# EAGLE design Espressomaschine (EAGLE 9.6.1)
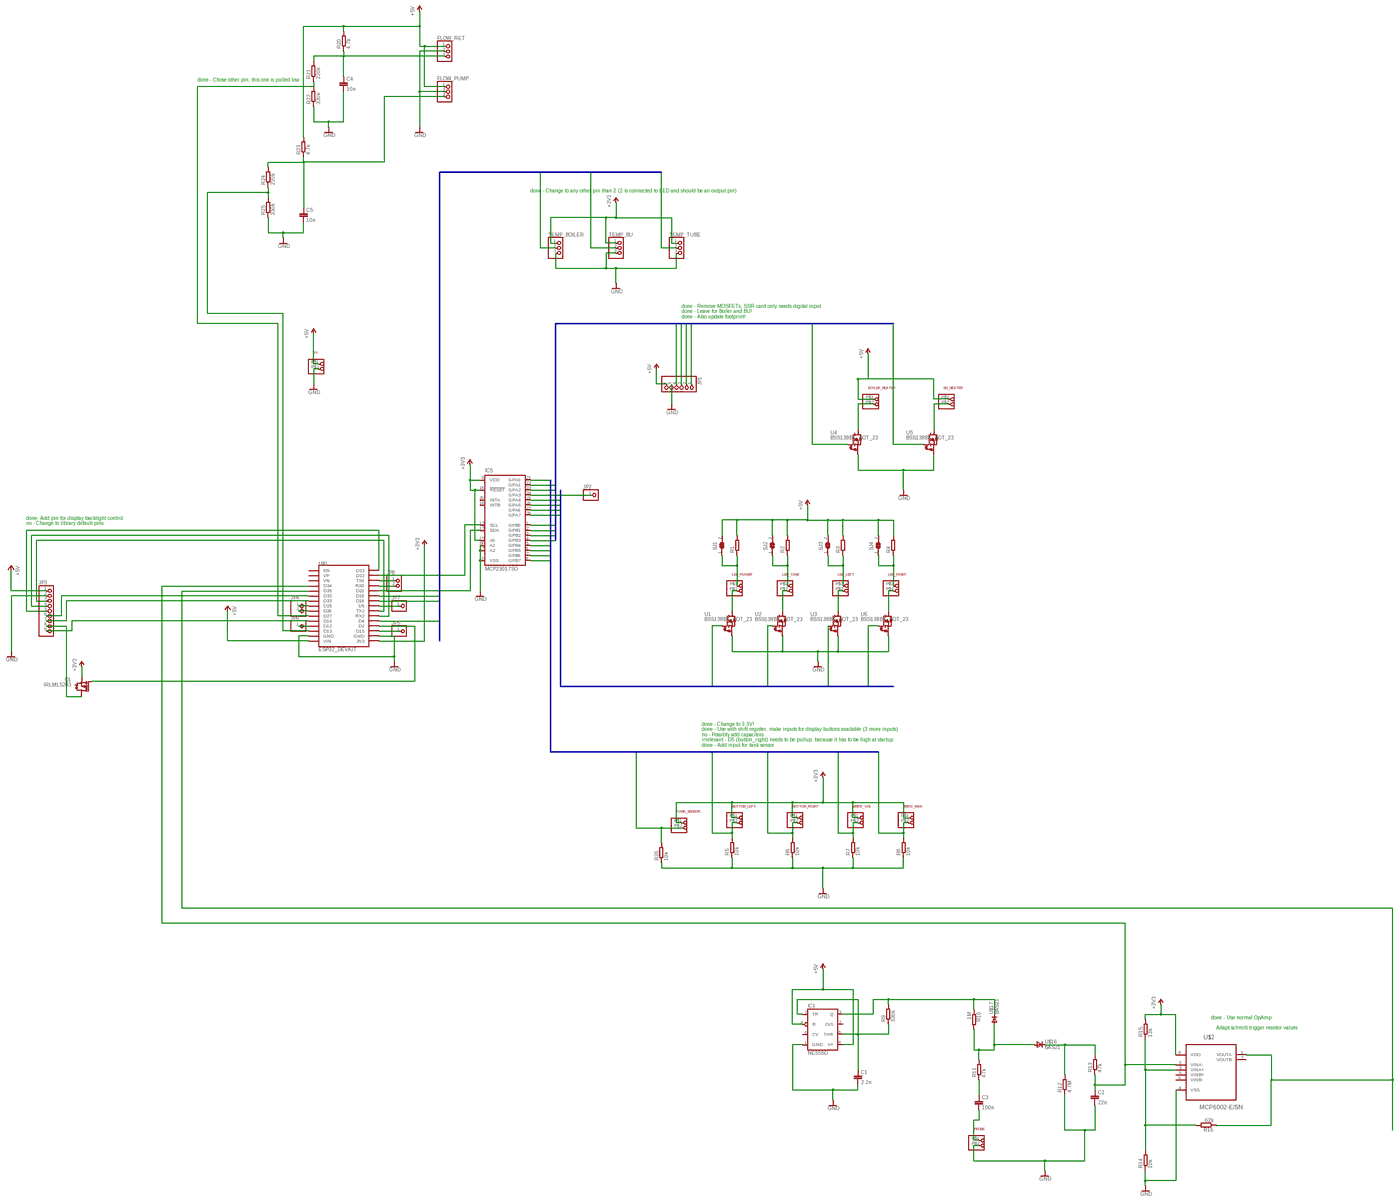
[diagram p0: schematic, sheet 1, overview]
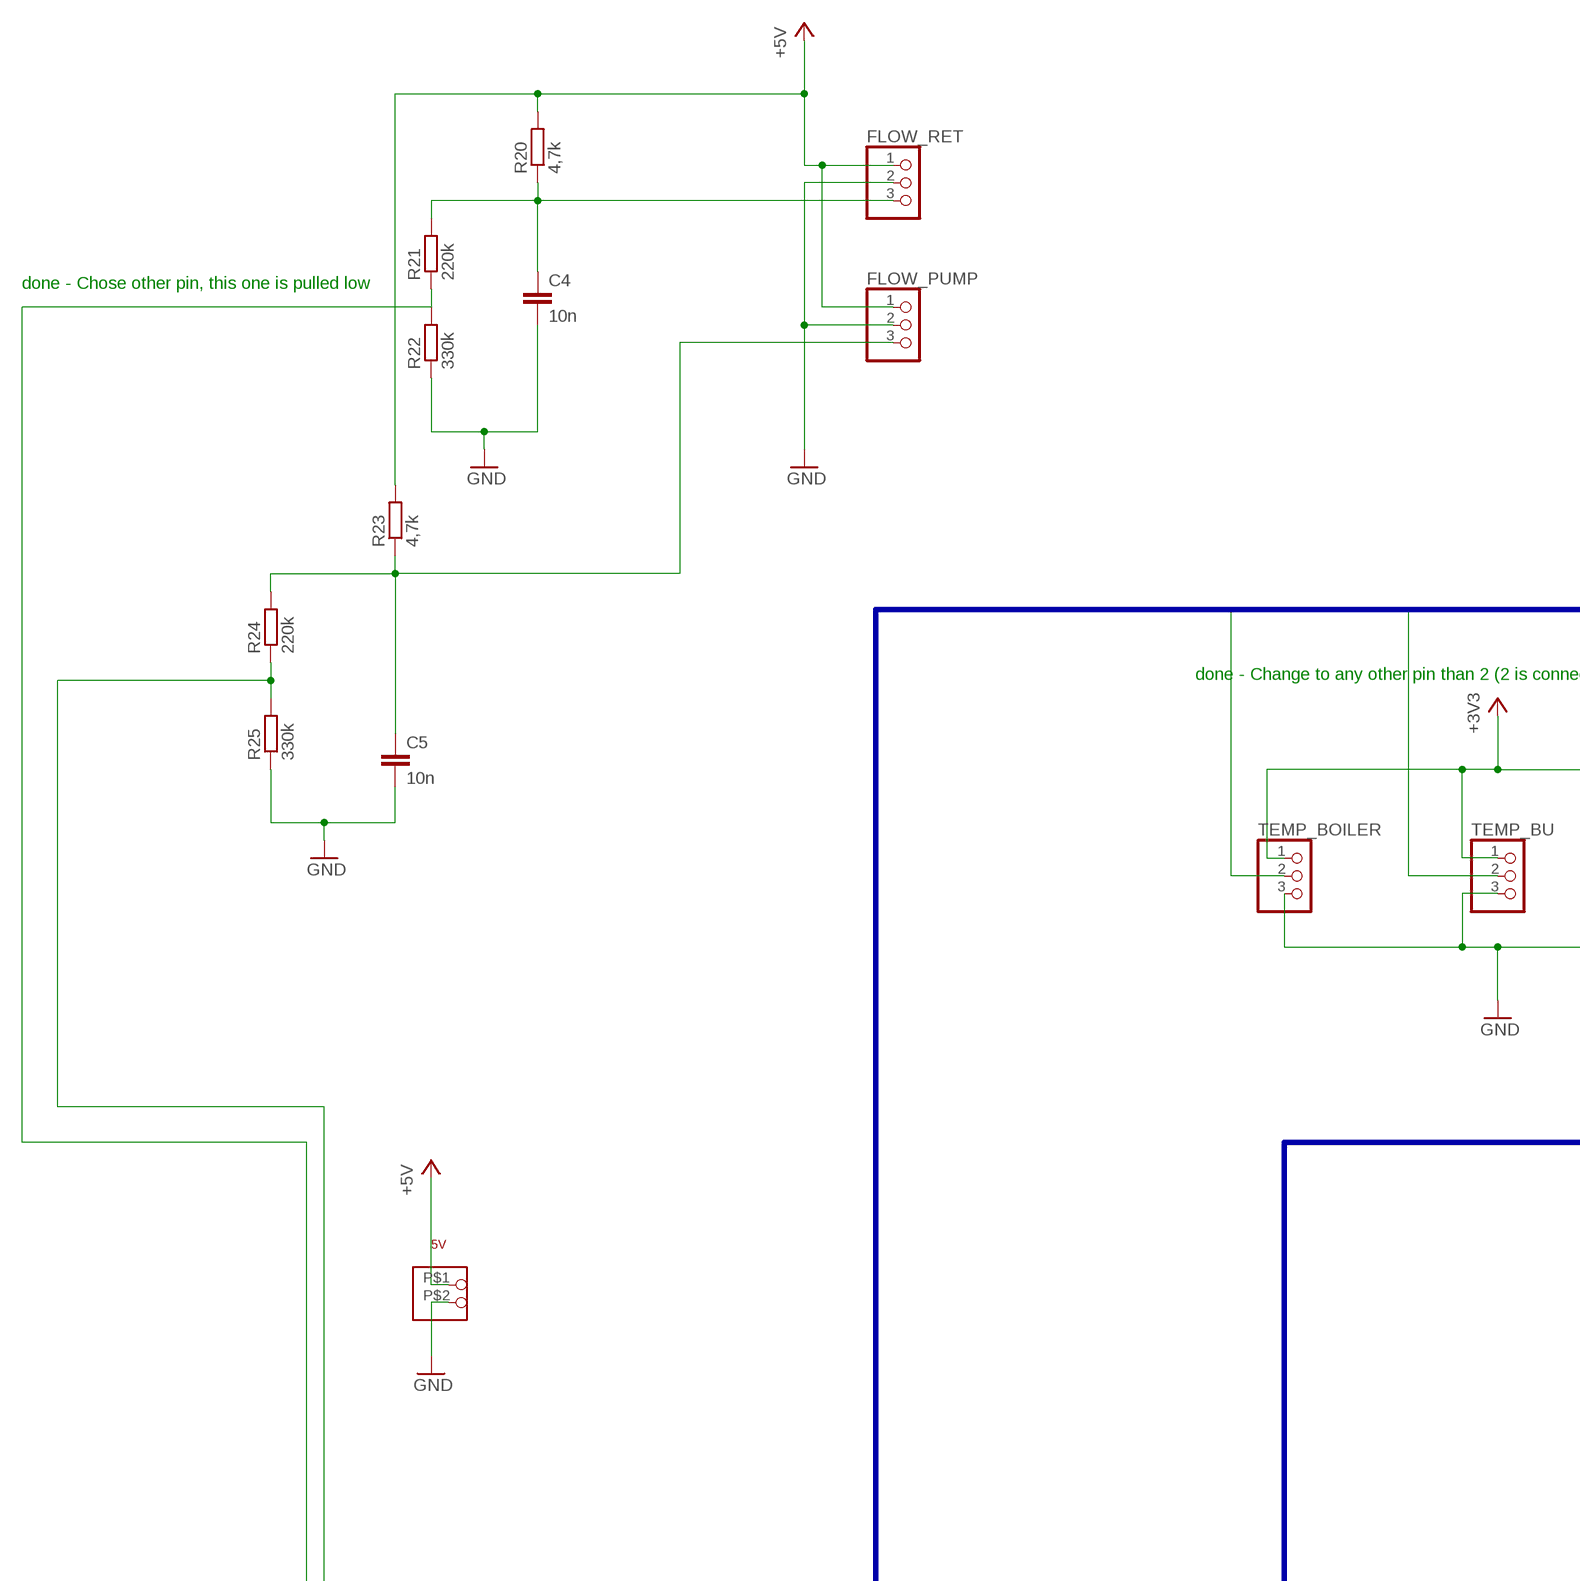
[diagram p1: schematic, sheet 1, part 1 of 4]
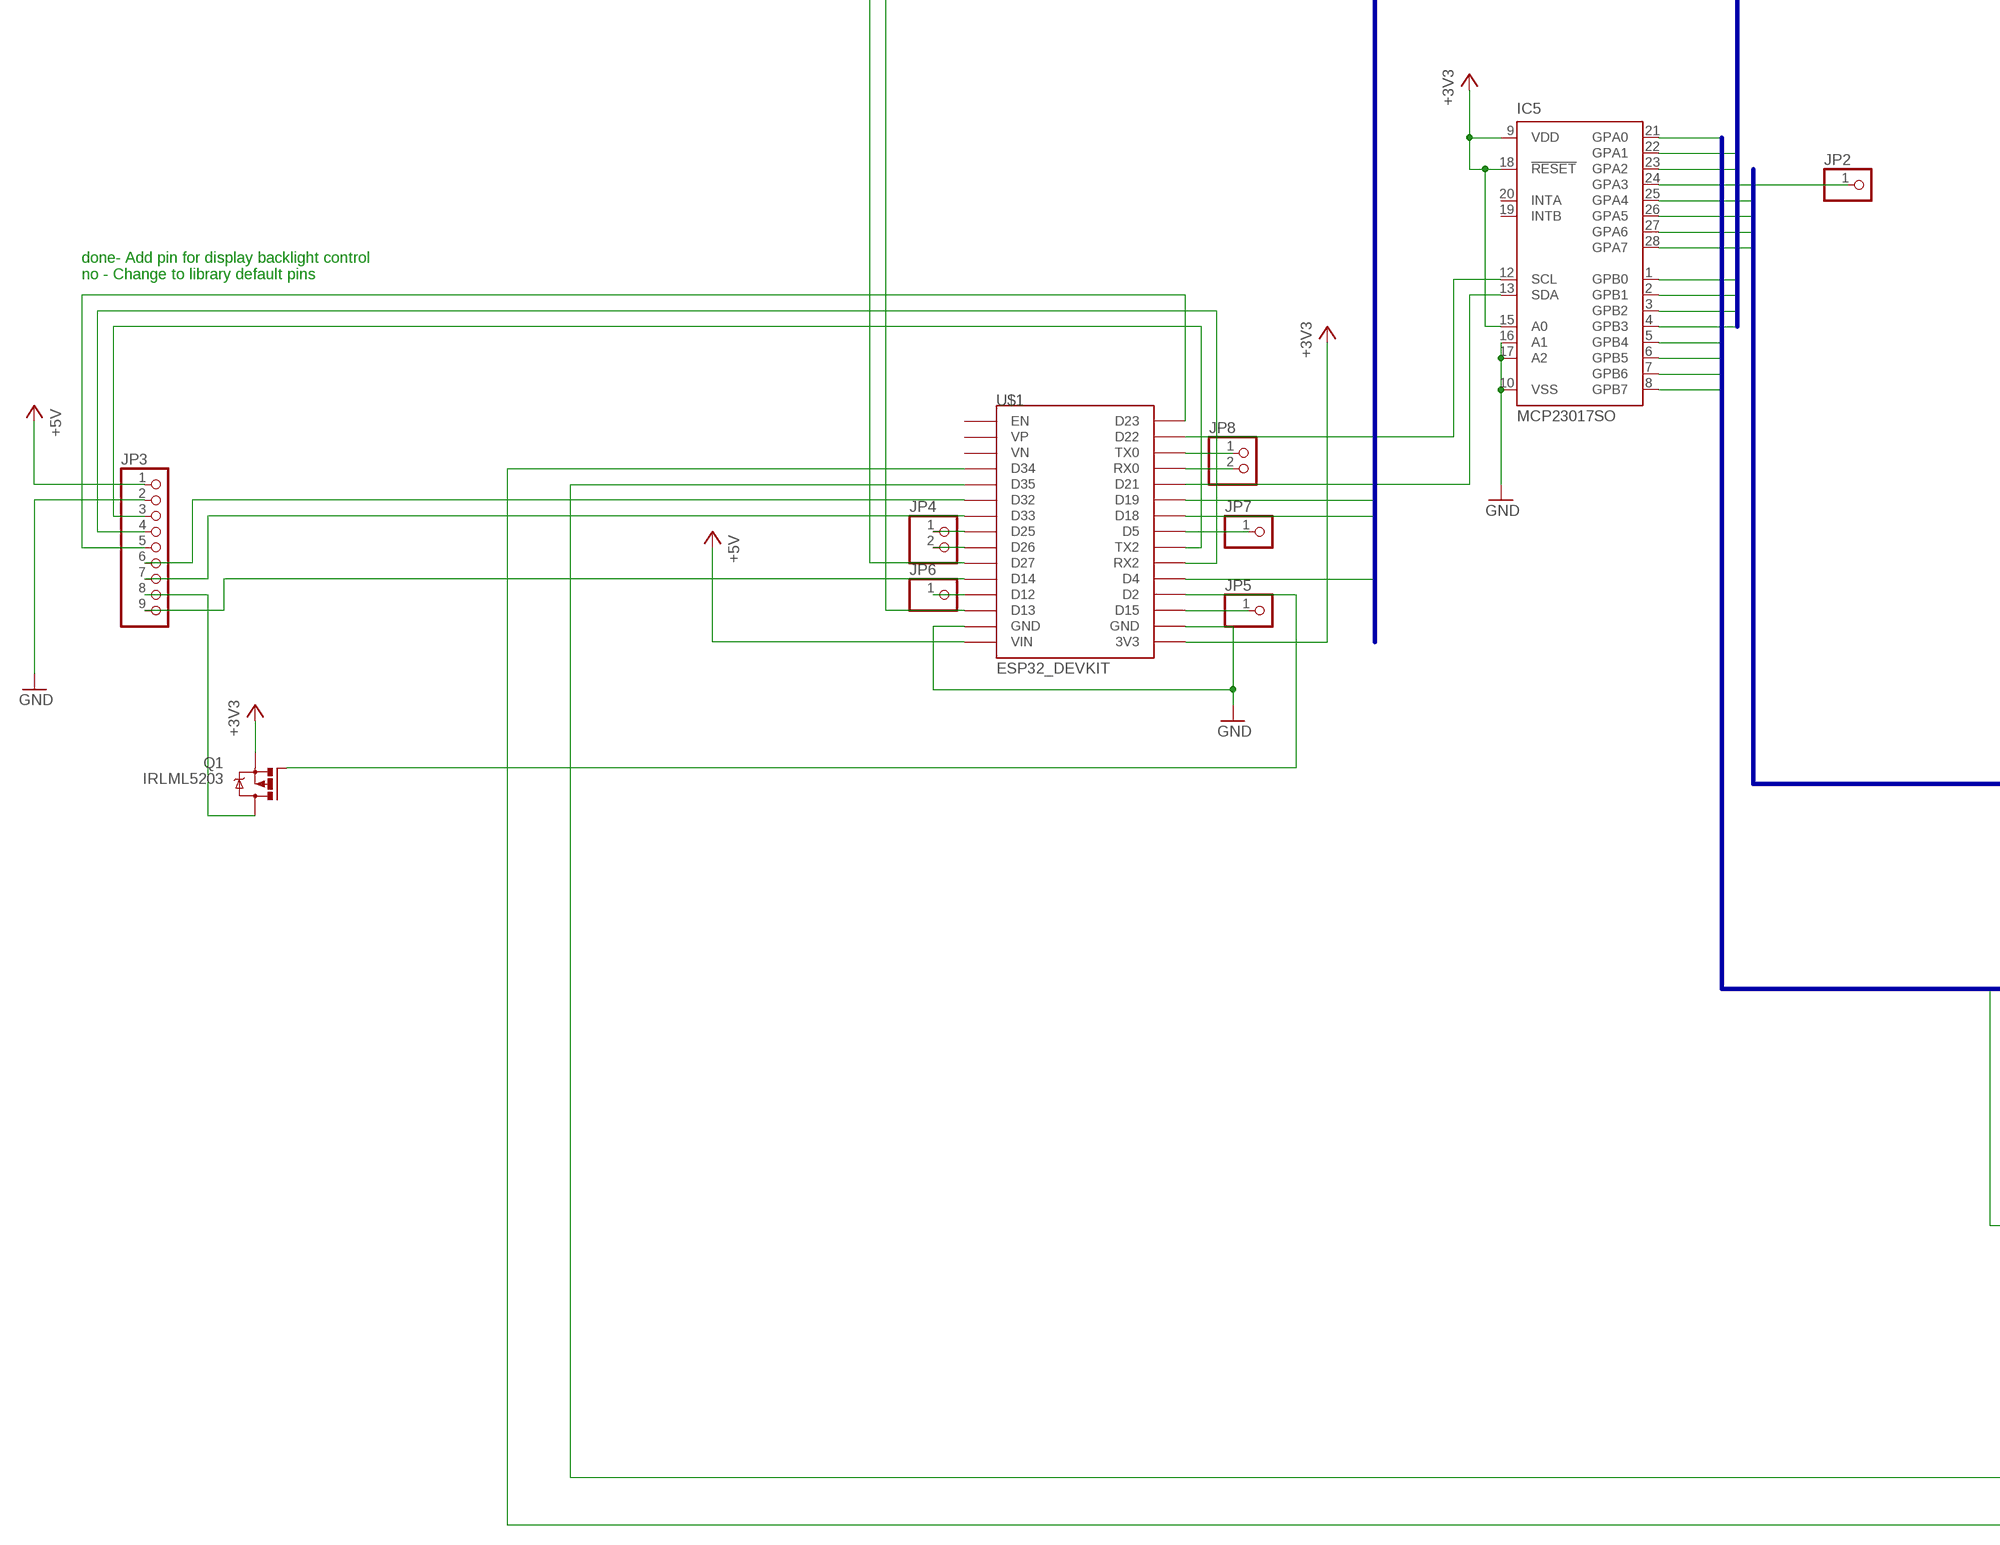
[diagram p2: schematic, sheet 1, part 2 of 4]
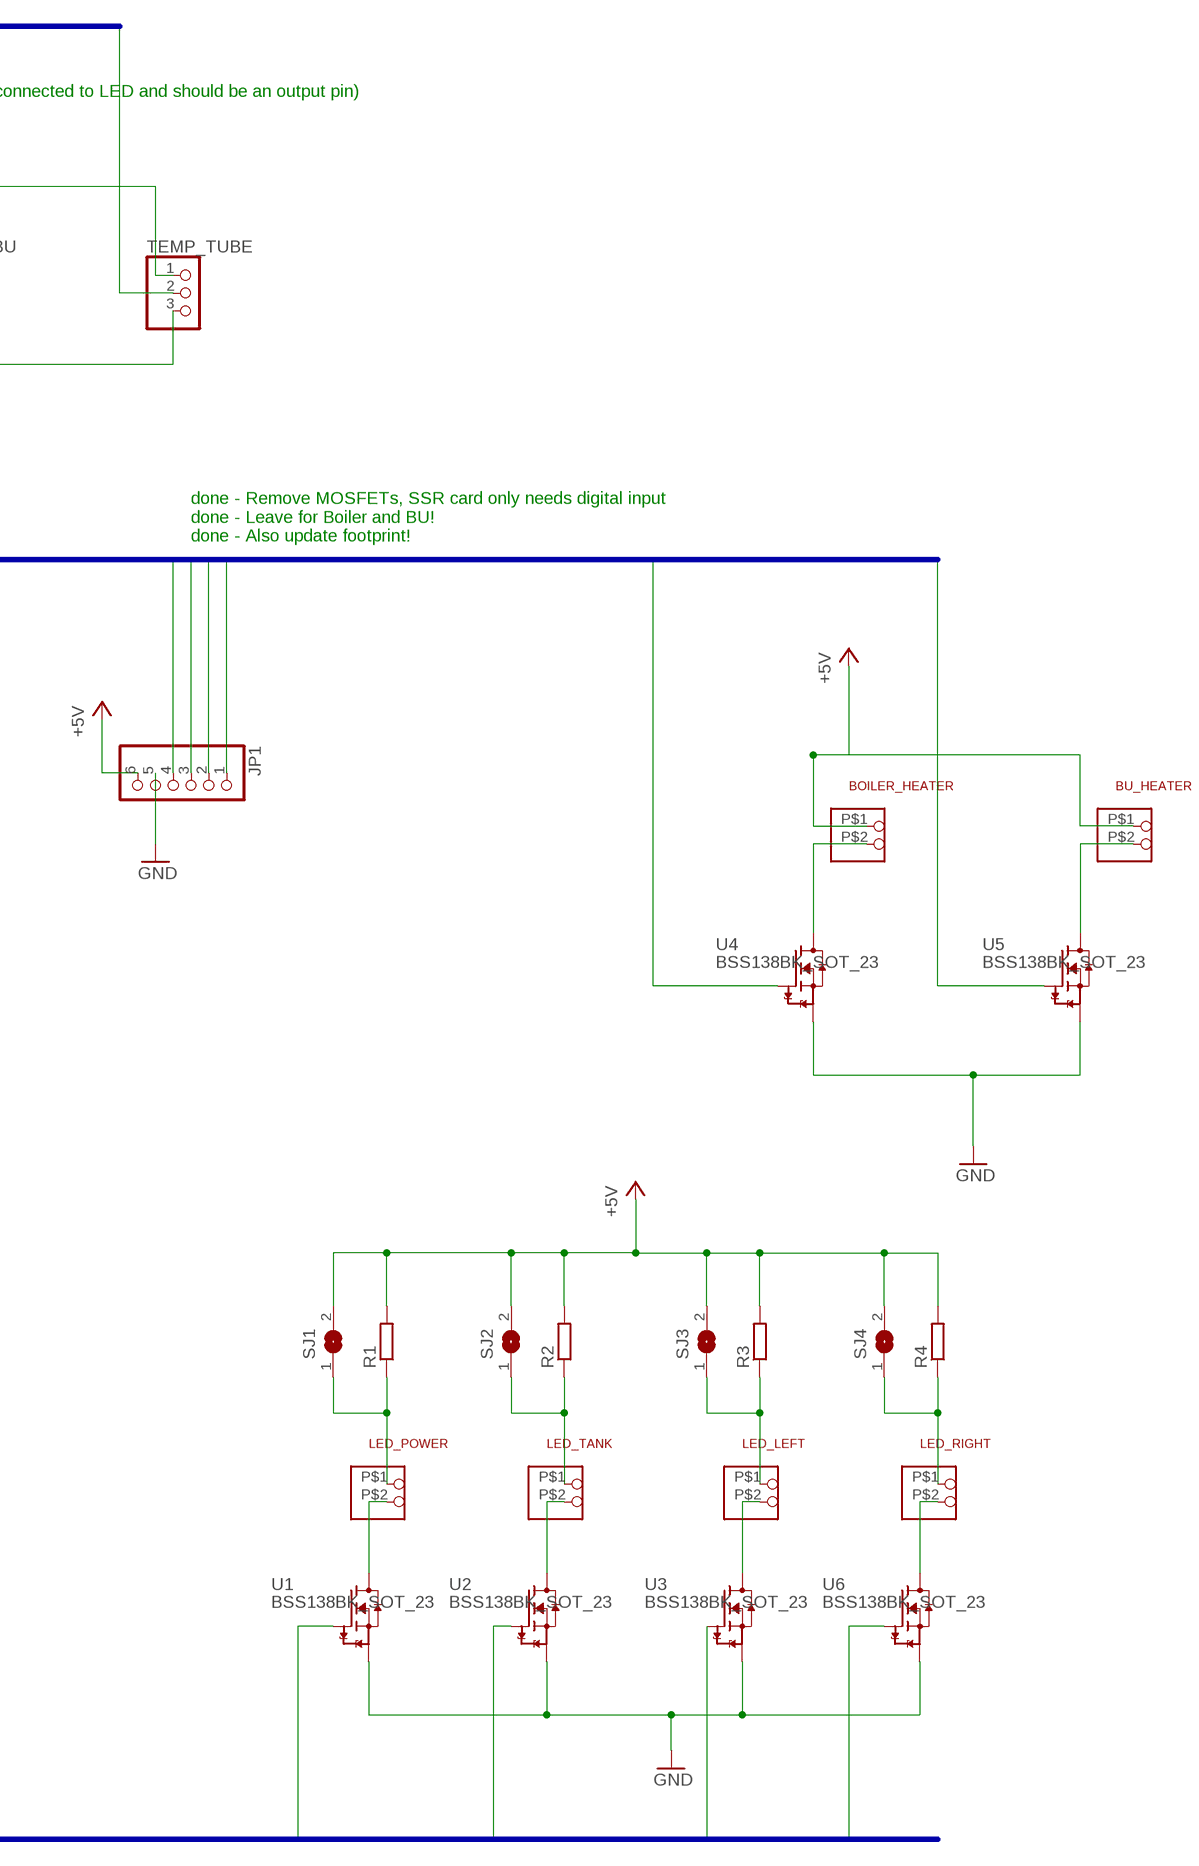
[diagram p3: schematic, sheet 1, part 3 of 4]
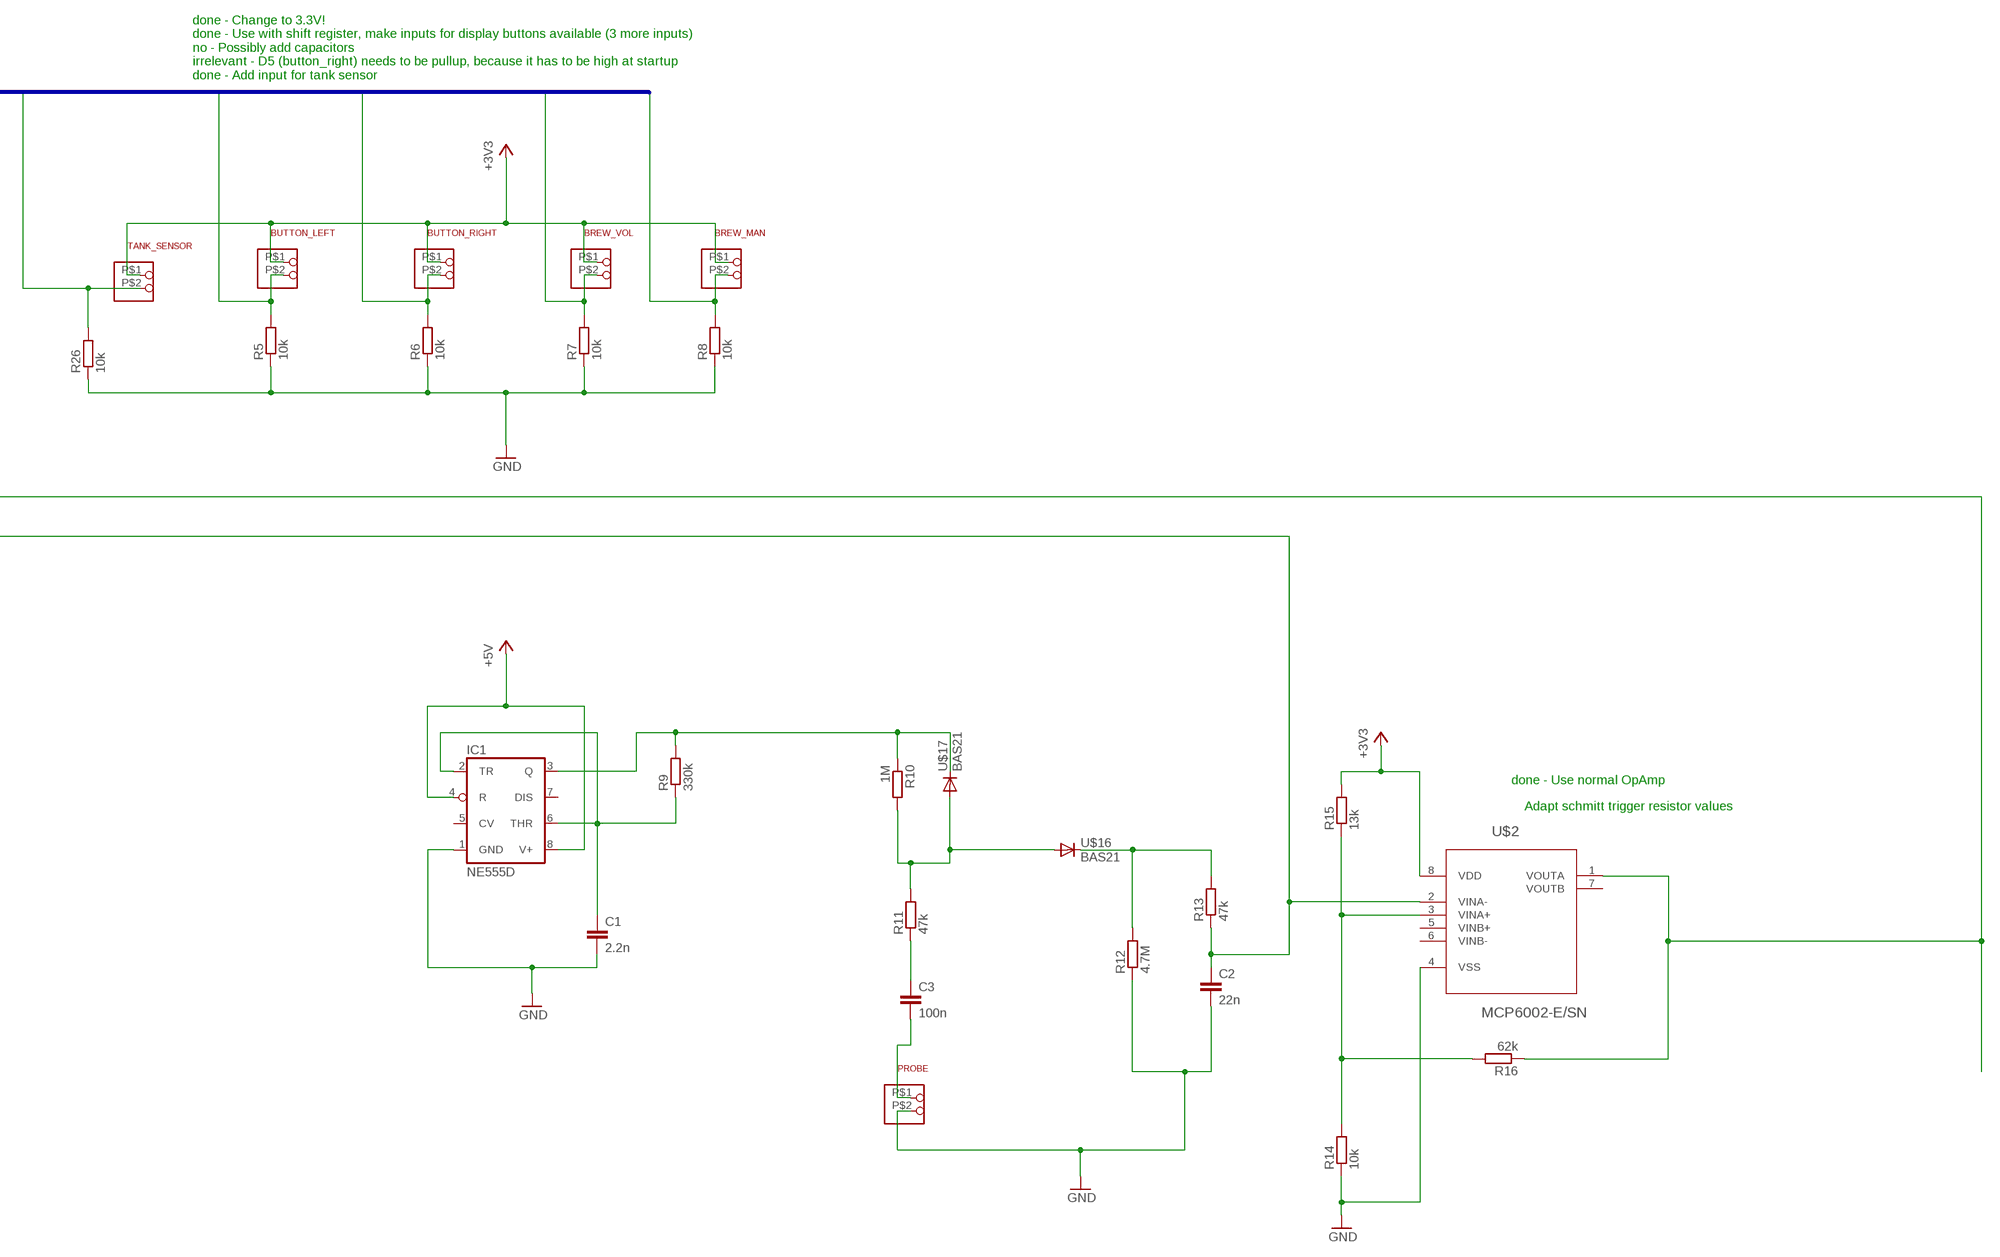
[diagram p4: schematic, sheet 1, part 4 of 4]

## Parts
5V  1X2RM5  [1X02_RM5]
BOILER_HEATER  1X2RM5  [1X02_RM5]
BREW_MAN  1X2RM5  [1X02_RM5]
BREW_VOL  1X2RM5  [1X02_RM5]
BU_HEATER  1X2RM5  [1X02_RM5]
BUTTON_LEFT  1X2RM5  [1X02_RM5]
BUTTON_RIGHT  1X2RM5  [1X02_RM5]
C1  2.2n  C-EUC0603  [C0603]
C2  22n  C-EUC0603  [C0603]
C3  100n  C-EUC0603  [C0603]
C4  10n  C-EUC0603  [C0603]
C5  10n  C-EUC0603  [C0603]
FLOW_PUMP  PINHD-1X3  [1X03]
FLOW_RET  PINHD-1X3  [1X03]
IC1  NE555D  [SO08]
IC5  MCP23017SO  [SO28W]
JP1  PINHD-1X6  [1X06]
JP2  PINHD-1X1  [1X01]
JP3  PINHD-1X9  [1X09]
JP4  PINHD-1X2  [1X02]
JP5  PINHD-1X1  [1X01]
JP6  PINHD-1X1  [1X01]
JP7  PINHD-1X1  [1X01]
JP8  PINHD-1X2  [1X02]
LED_LEFT  1X2RM5  [1X02_RM5]
LED_POWER  1X2RM5  [1X02_RM5]
LED_RIGHT  1X2RM5  [1X02_RM5]
LED_TANK  1X2RM5  [1X02_RM5]
PROBE  1X2RM5  [1X02_RM5]
Q1  IRLML5203  [MICRO3]
R1  R-EU_R0603  [R0603]
R2  R-EU_R0603  [R0603]
R3  R-EU_R0603  [R0603]
R4  R-EU_R0603  [R0603]
R5  10k  R-EU_R0603  [R0603]
R6  10k  R-EU_R0603  [R0603]
R7  10k  R-EU_R0603  [R0603]
R8  10k  R-EU_R0603  [R0603]
R9  330k  R-EU_R0603  [R0603]
R10  1M  R-EU_R0603  [R0603]
R11  47k  R-EU_R0603  [R0603]
R12  4.7M  R-EU_R0603  [R0603]
R13  47k  R-EU_R0603  [R0603]
R14  10k  R-EU_R0603  [R0603]
R15  13k  R-EU_R0603  [R0603]
R16  62k  R-EU_R0603  [R0603]
R20  4,7k  R-EU_R0603  [R0603]
R21  220k  R-EU_R0603  [R0603]
R22  330k  R-EU_R0603  [R0603]
R23  4,7k  R-EU_R0603  [R0603]
R24  220k  R-EU_R0603  [R0603]
R25  330k  R-EU_R0603  [R0603]
R26  10k  R-EU_R0603  [R0603]
SJ1  SJ  [SJ]
SJ2  SJ  [SJ]
SJ3  SJ  [SJ]
SJ4  SJ  [SJ]
TANK_SENSOR  1X2RM5  [1X02_RM5]
TEMP_BOILER  PINHD-1X3  [1X03]
TEMP_BU  PINHD-1X3  [1X03]
TEMP_TUBE  PINHD-1X3  [1X03]
U1  BSS138BK_SOT_23  [SOT23]
U2  BSS138BK_SOT_23  [SOT23]
U3  BSS138BK_SOT_23  [SOT23]
U4  BSS138BK_SOT_23  [SOT23]
U5  BSS138BK_SOT_23  [SOT23]
U6  BSS138BK_SOT_23  [SOT23]
U$1  ESP32_DEVKIT  [ESP32_DEVKIT]
U$2  MCP6002-E/SN  [SOIC127P600X175-8N]
U$16  BAS21  [SOT23]
U$17  BAS21  [SOT23]

## Nets
+3V3: BREW_MAN.P$1 BREW_VOL.P$1 BUTTON_LEFT.P$1 BUTTON_RIGHT.P$1 IC5.9(VDD) IC5.15(A0) IC5.18(!RESET) Q1.2(S) R15.2 TANK_SENSOR.P$1 TEMP_BOILER.1 TEMP_BU.1 TEMP_TUBE.1 U$1.3V3 U$2.8(VDD)
+5V: 5V.P$1 BOILER_HEATER.P$1 BU_HEATER.P$1 FLOW_PUMP.1 FLOW_RET.1 IC1.4(R) IC1.8(V+) JP1.6 JP3.1 R1.2 R2.2 R3.2 R4.2 R20.2 R23.2 SJ1.2 SJ2.2 SJ3.2 SJ4.2 U$1.VIN
BOILER_HEATER: IC5.23(GPA2) U4.1(G)
BOILER_VALVE: IC5.1(GPB0) JP1.4
BREW_MAN: BREW_MAN.P$2 IC5.8(GPB7) R8.2
BREW_VOL: BREW_VOL.P$2 IC5.7(GPB6) R7.2
BU_HEATER: IC5.22(GPA1) U5.1(G)
BU_VALVE: IC5.2(GPB1) JP1.3
BUTTON_LEFT: BUTTON_LEFT.P$2 IC5.6(GPB5) R5.2
BUTTON_RIGHT: BUTTON_RIGHT.P$2 IC5.5(GPB4) R6.2
EXP_VALVE: IC5.4(GPB3) JP1.1
GND: 5V.P$2 C1.2 C2.2 C4.2 C5.2 FLOW_PUMP.2 FLOW_RET.2 IC1.1(GND) IC5.10(VSS) IC5.16(A1) IC5.17(A2) JP1.5 JP3.2 PROBE.P$2 R5.1 R6.1 R7.1 R8.1 R12.1 R14.1 R22.1 R25.1 R26.1 TEMP_BOILER.3 TEMP_BU.3 TEMP_TUBE.3 U1.2(S) U2.2(S) U3.2(S) U4.2(S) U5.2(S) U6.2(S) U$1.GND@1(GND) U$1.GND@2(GND) U$2.4(VSS)
LED_LEFT: IC5.25(GPA4) U3.1(G)
LED_POWER: IC5.26(GPA5) U1.1(G)
LED_RIGHT: IC5.28(GPA7) U6.1(G)
LED_TANK: IC5.27(GPA6) U2.1(G)
N$1: LED_POWER.P$1 R1.1 SJ1.1
N$2: LED_TANK.P$1 R2.1 SJ2.1
N$3: LED_LEFT.P$1 R3.1 SJ3.1
N$4: Q1.1(G) U$1.D2
N$5: LED_RIGHT.P$2 U6.3(D)
N$6: LED_LEFT.P$2 U3.3(D)
N$7: BOILER_HEATER.P$2 U4.3(D)
N$8: BU_HEATER.P$2 U5.3(D)
N$9: LED_RIGHT.P$1 R4.1 SJ4.1
N$10: C1.1 IC1.2(TR) IC1.6(THR) R9.1
N$11: R10.2 R11.2 U$16.1(A) U$17.1(A)
N$12: C3.1 R11.1
N$13: IC1.3(Q) R9.2 R10.1 U$17.3(C)
N$14: R12.2 R13.2 U$16.3(C)
N$15: C2.1 R13.1 U$1.D34 U$2.2(VINA-)
N$16: R14.2 R15.1 R16.2 U$2.3(VINA+)
N$17: C3.2 PROBE.P$1
N$18: R16.1 U$1.D35 U$2.1(VOUTA)
N$19: IC5.24(GPA3) JP2.1
N$20: JP7.1 U$1.D5
N$21: LED_TANK.P$2 U2.3(D)
N$22: IC5.12(SCL) U$1.D22
N$23: LED_POWER.P$2 U1.3(D)
N$24: JP3.8 Q1.3(D)
N$25: JP4.1 U$1.D25
N$26: JP3.3 U$1.TX2
N$27: JP3.4 U$1.RX2
N$28: JP3.5 U$1.D23
N$29: JP3.6 U$1.D32
N$30: JP3.7 U$1.D33
N$31: JP3.9 U$1.D14
N$32: C4.1 FLOW_RET.3 R20.1 R21.2
N$33: C5.1 FLOW_PUMP.3 R23.1 R24.2
N$34: IC5.13(SDA) U$1.D21
N$35: R21.1 R22.2 U$1.D27
N$36: JP4.2 U$1.D26
N$37: JP5.1 U$1.D15
N$38: R24.1 R25.2 U$1.D13
N$39: JP6.1 U$1.D12
N$40: JP8.1 U$1.TX0
N$41: JP8.2 U$1.RX0
PUMP: IC5.3(GPB2) JP1.2
TANK_SENSOR: IC5.21(GPA0) R26.2 TANK_SENSOR.P$2
TEMP_BOILER: TEMP_BOILER.2 U$1.D19
TEMP_BU: TEMP_BU.2 U$1.D4
TEMP_TUBE: TEMP_TUBE.2 U$1.D18
Unconnected: IC1.5(CV) IC1.7(DIS) IC5.19(INTB) IC5.20(INTA) U$1.EN U$1.VN U$1.VP U$2.5(VINB+) U$2.6(VINB-) U$2.7(VOUTB)

## Buses
LED_LEFT,LED_POWER,LED_RIGHT,LED_TANK
BOILER_HEATER,BOILER_VALVE,BU_HEATER,BU_VALVE,EXP_VALVE,PUMP
BREW_MAN,BREW_VOL,BUTTON_LEFT,BUTTON_RIGHT,TANK_SENSOR
TEMP_BOILER,TEMP_BU,TEMP_TUBE

## Notes on the sheet
- done - Chose other pin, this one is pulled low
- done - Change to any other pin than 2 (2 is connected to LED and should be an output pin)
- done - Remove MOSFETs, SSR card only needs digital input
  done - Leave for Boiler and BU!
  done - Also update footprint!
- done- Add pin for display backlight control
  no - Change to library default pins
- done - Change to 3.3V!
  done - Use with shift register, make inputs for display buttons available (3 more inputs)
  no - Possibly add capacitors
  irrelevant - D5 (button_right) needs to be pullup, because it has to be high at startup
  done - Add input for tank sensor
- done - Use normal OpAmp
- Adapt schmitt trigger resistor values

## Library data of the parts
5V BOILER_HEATER BREW_MAN BREW_VOL BU_HEATER BUTTON_LEFT BUTTON_RIGHT LED_LEFT LED_POWER LED_RIGHT LED_TANK PROBE TANK_SENSOR = PINHD_eigen:1X2RM5
C1-C5 = rcl:C-EU: CAPACITOR, European symbol; SPICEPREFIX: C
FLOW_PUMP FLOW_RET TEMP_BOILER TEMP_BU TEMP_TUBE = pinhead:PINHD-1X3: PIN HEADER
IC1 = linear:*555: TIMER
IC5 = microchip:MCP23017: http://ww1.microchip.com/downloads/en/DeviceDoc/21952a.pdf Source: http://ww1.microchip.com/downloads/en/DeviceDoc/21952a.pdf; MF: MICROCHIP; MPN: MCP23017-E/SO; OC_FARNELL: 1332087; OC_NEWARK: 31K2958
JP1 = pinhead:PINHD-1X6: PIN HEADER
JP2 JP5-JP7 = pinhead:PINHD-1X1: PIN HEADER
JP3 = pinhead:PINHD-1X9: PIN HEADER
JP4 JP8 = pinhead:PINHD-1X2: PIN HEADER
Q1 = transistor-power:IRLML5203: HEXFET P-Channel Power MOSFET
R1-R16 R20-R26 = rcl:R-EU_: RESISTOR, European symbol; SPICEPREFIX: R
SJ1-SJ4 = jumper:SJ: SMD solder JUMPER
U1-U6 = Transistor:BSS138BK: N-channel Trench MOSFET
U$1 = ESP32:ESP32_DEVKIT: ESP32 DEVKIT BOARD
U$2 = Microchip_By_element14_Batch_1:MCP6002-E/SN: Low-Power Op Amp; DESCRIPTION: Low-Power Op Amp; MPN: MCP6002-E/SN; OC_FARNELL: 1332118; OC_NEWARK: 34M7473; PACKAGE: SOIC-8; SUPPLIER: Microchip
U$16 U$17 = Diode:BAS21

## Board
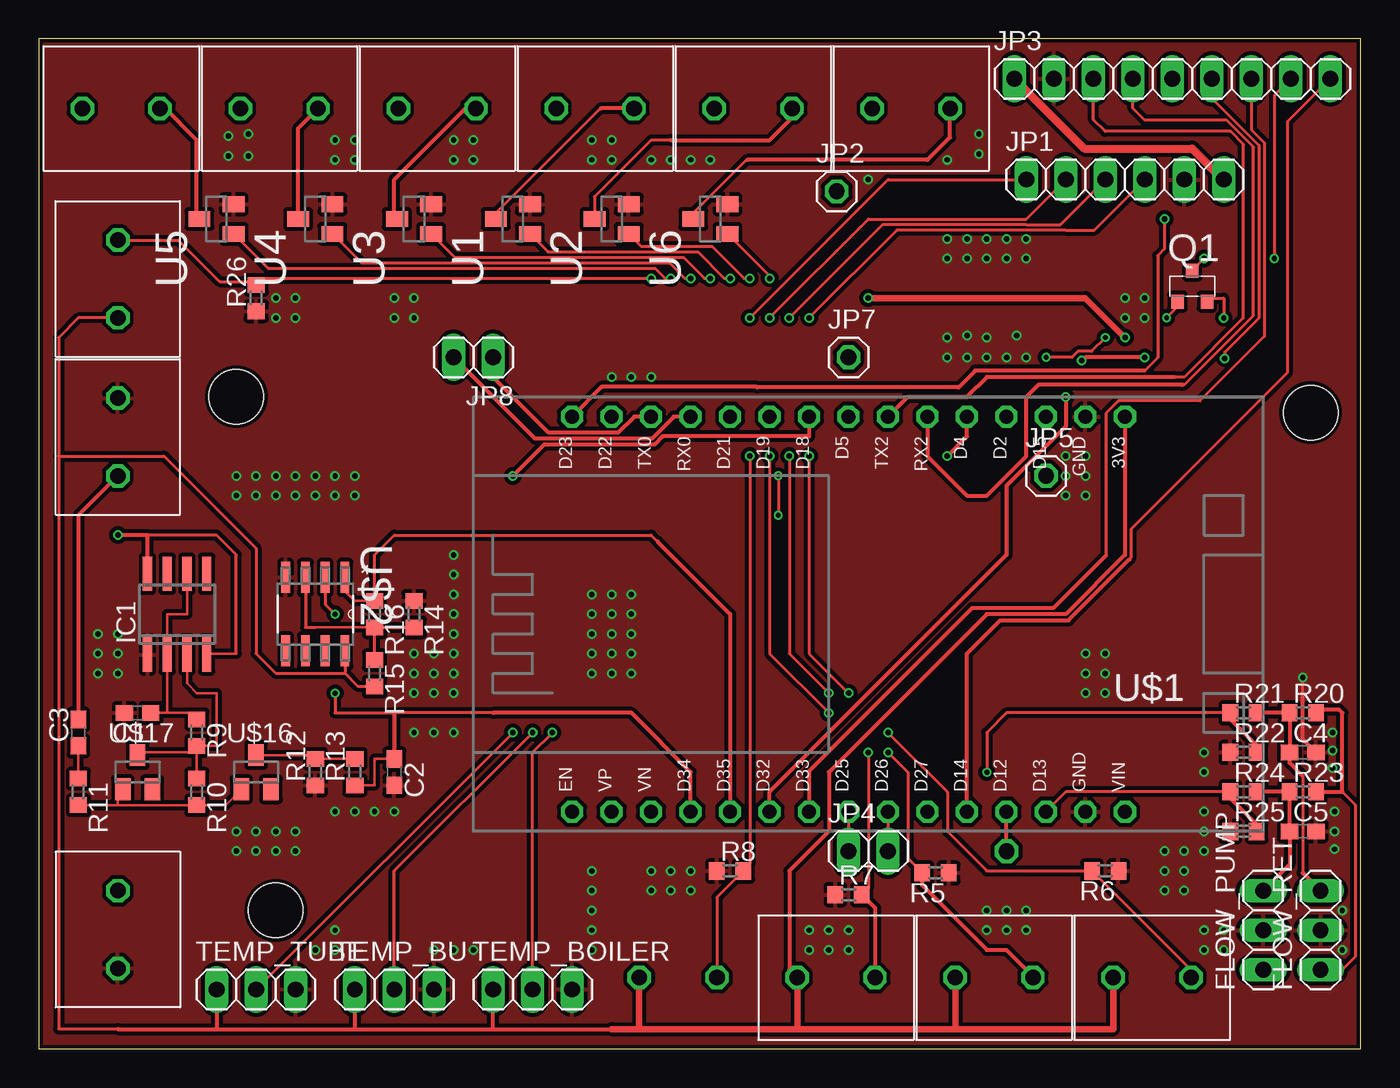
[diagram p5: board, top side]
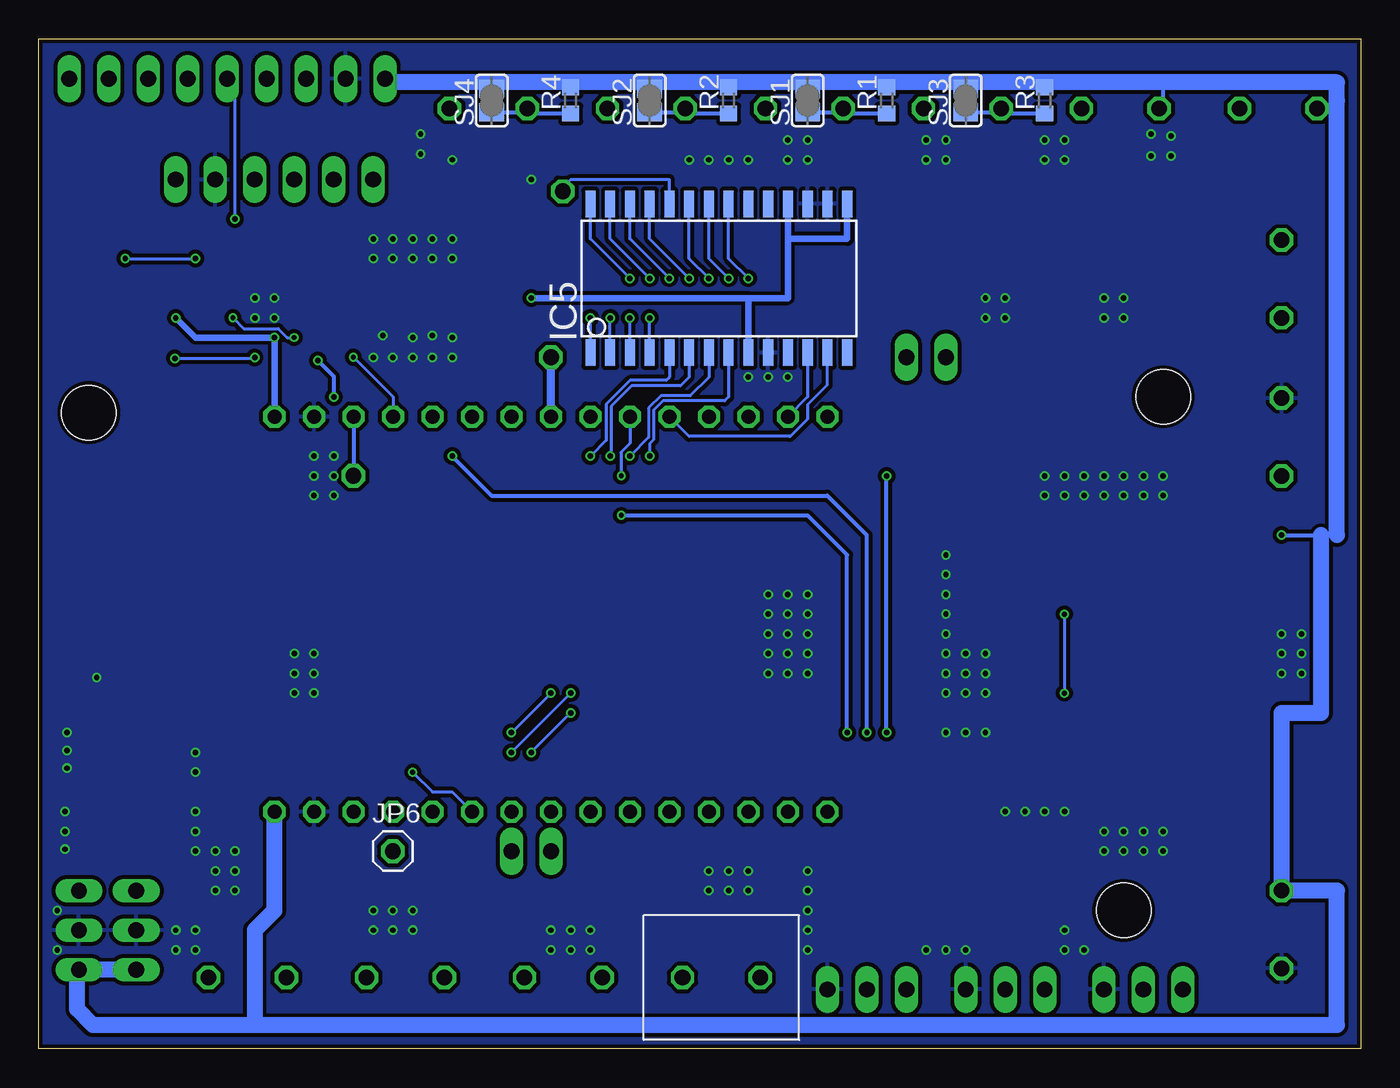
[diagram p6: board, bottom side, seen from below]

Size 85 x 64.92 mm. Coordinates in mm from the lower left corner, seen from the top.
Outline: 0,0 85,0 85,64.92 0,64.92 0,0
Copper layers (1*16): Top 0.035mm / dielectric 1.5mm / Bottom 0.035mm
Design rules "JLCpcb_2_layer": minimum track width 5mil, minimum drill 0.2mm, track to track 5mil, track to pad 0.2mm, pad to pad 0.54mm, via to via 0.28mm, smd to smd 0mil, copper to edge 10mil, drill to drill 10mil, minimum pad ring 0.13mm, minimum via ring 0.13mm, stop-mask expansion 0.05mm, vias tented up to drill 100mil, thermal gap 10mil
Holes 3.5 mm at 12.7,41.91 15.24,8.89 81.79,40.89

### Footprints (pad centres in the part's own frame; a part is rotated, then mirrored left to right if it is on the bottom)
1X02_RM5 = drill 1 octagon: P$1 0,0; P$2 5,0
C0603 = smd 1.1 x 1: 1 -0.85,0; 2 0.85,0
1X03 = drill 1.016 long: 1 -2.54,0; 2 0,0; 3 2.54,0
SO08 = smd 0.6 x 2.2: 1 -1.905,-2.6; 2 -0.635,-2.6; 3 0.635,-2.6; 4 1.905,-2.6; 5 1.905,2.6; 6 0.635,2.6; 7 -0.635,2.6; 8 -1.905,2.6
SO28W = smd 0.65 x 1.7: 1 -7.62,-4.78; 2 -6.35,-4.78; 3 -5.08,-4.78; 4 -3.81,-4.78; 5 -2.54,-4.78; 6 -1.27,-4.78; 7 0,-4.78; 8 1.27,-4.78; 9 2.54,-4.78; 10 3.81,-4.78; 11 5.08,-4.78; 12 6.35,-4.78; 13 7.62,-4.78; 14 8.89,-4.78; 15 8.89,4.78; 16 7.62,4.78; 17 6.35,4.78; 18 5.08,4.78; 19 3.81,4.78; 20 2.54,4.78; 21 1.27,4.78; 22 0,4.78; 23 -1.27,4.78; 24 -2.54,4.78; 25 -3.81,4.78; 26 -5.08,4.78; 27 -6.35,4.78; 28 -7.62,4.78
1X06 = drill 1.016 long: 1 -6.35,0; 2 -3.81,0; 3 -1.27,0; 4 1.27,0; 5 3.81,0; 6 6.35,0
1X01 = drill 1.016 octagon: 1 0,0
1X09 = drill 1.016 long: 1 -10.16,0; 2 -7.62,0; 3 -5.08,0; 4 -2.54,0; 5 0,0; 6 2.54,0; 7 5.08,0; 8 7.62,0; 9 10.16,0
1X02 = drill 1.016 long: 1 -1.27,0; 2 1.27,0
MICRO3 = smd 0.8 x 0.9: 1 -0.95,-1; 2 0.95,-1; 3 0,1
R0603 = smd 1 x 1.1: 1 -0.85,0; 2 0.85,0
SJ = smd 1.168 x 1.6: 1 -0.762,0; 2 0.762,0
SOT23 = smd 1 x 1.4: 1 -0.95,-1.1; 2 0.95,-1.1; 3 0,1.1
ESP32_DEVKIT = drill 0.9 pad 1.422 octagon: 3V3 11.43,-17.78; D2 11.43,-10.16; D4 11.43,-7.62; D5 11.43,0; D12 -13.97,-10.16; D13 -13.97,-12.7; D14 -13.97,-7.62; D15 11.43,-12.7; D18 11.43,2.54; D19 11.43,5.08; D21 11.43,7.62; D22 11.43,15.24; D23 11.43,17.78; D25 -13.97,0; D26 -13.97,-2.54; D27 -13.97,-5.08; D32 -13.97,5.08; D33 -13.97,2.54; D34 -13.97,10.16; D35 -13.97,7.62; EN -13.97,17.78; GND@1 -13.97,-15.24; GND@2 11.43,-15.24; RX0 11.43,10.16; RX2 11.43,-5.08; TX0 11.43,12.7; TX2 11.43,-2.54; VIN -13.97,-17.78; VN -13.97,12.7; VP -13.97,15.24
SOIC127P600X175-8N = smd 1.981 x 0.559: 1 -2.362,1.905; 2 -2.362,0.635; 3 -2.362,-0.635; 4 -2.362,-1.905; 5 2.362,-1.905; 6 2.362,-0.635; 7 2.362,0.635; 8 2.362,1.905

### Placement (x,y rotation side)
5V  5.08,10.16 270 top
BOILER_HEATER  12.95,60.45 0 top
BREW_MAN  38.61,4.57 180 bottom
BREW_VOL  48.77,4.57 0 top
BU_HEATER  2.79,60.45 0 top
BUTTON_LEFT  58.93,4.57 0 top
BUTTON_RIGHT  69.09,4.57 0 top
C1  6.35,21.59 180 top
C2  22.86,17.78 270 top
C3  2.54,20.32 90 top
C4  81.28,19.05 0 top
C5  81.28,13.97 0 top
FLOW_PUMP  78.74,7.62 90 top
FLOW_RET  82.42,7.62 90 top
IC1  8.89,27.94 0 top
IC5  41.91,49.53 0 bottom
JP1  69.85,55.88 0 top
JP2  51.31,55.12 0 top
JP3  72.9,62.36 0 top
JP4  53.34,12.7 0 top
JP5  64.77,36.83 0 top
JP6  62.23,12.7 0 bottom
JP7  52.07,44.45 0 top
JP8  27.94,44.45 180 top
LED_LEFT  23.11,60.45 0 top
LED_POWER  33.27,60.45 0 top
LED_RIGHT  53.59,60.45 0 top
LED_TANK  43.43,60.45 0 top
PROBE  5.08,36.83 90 top
Q1  74.17,49.02 0 top
R1  30.48,60.96 90 bottom
R2  40.64,60.96 90 bottom
R3  20.32,60.96 90 bottom
R4  50.8,60.96 90 bottom
R5  57.66,11.3 180 top
R6  68.58,11.43 180 top
R7  52.07,9.91 0 top
R8  44.45,11.43 0 top
R9  10.16,20.32 270 top
R10  10.16,16.51 270 top
R11  2.54,16.51 270 top
R12  17.78,17.78 90 top
R13  20.32,17.78 90 top
R14  24.13,27.94 270 top
R15  21.59,24.13 270 top
R16  21.59,27.94 270 top
R20  81.28,21.59 0 top
R21  77.47,21.59 0 top
R22  77.47,19.05 0 top
R23  81.28,16.51 0 top
R24  77.47,16.51 0 top
R25  77.47,13.97 0 top
R26  13.97,48.26 90 top
SJ1  35.56,60.96 90 bottom
SJ2  45.72,60.96 90 bottom
SJ3  25.4,60.96 90 bottom
SJ4  55.88,60.96 90 bottom
TANK_SENSOR  5.08,46.99 90 top
TEMP_BOILER  31.75,3.81 0 top
TEMP_BU  22.86,3.81 0 top
TEMP_TUBE  13.97,3.81 0 top
U1  30.48,53.34 90 top
U2  36.83,53.34 90 top
U3  24.13,53.34 90 top
U4  17.78,53.34 90 top
U5  11.43,53.34 90 top
U6  43.18,53.34 90 top
U$1  52.07,29.21 90 top
U$2  17.78,27.94 270 top
U$16  13.97,17.78 0 top
U$17  6.35,17.78 0 top

### Tracks (layer width: path | path; a pad name or v marks a point on that pad's centre or on a via)
+3V3  (via drill 0.35)
  Top 0.2: Q1.2 75.36,48.26 76.2,48.26 | U$2.8 19.68,24.13 | 19.68,24.13 15.24,24.13 13.97,25.4 13.97,32.18 8.05,38.1 1.27,38.1 | R15.2 20.54,23.28 19.68,24.13
  Top 0.203: 76.2,48.26 v76.2,46.99 | TANK_SENSOR.P$1 2.54,46.99 1.27,45.72 1.27,38.1 1.27,1.27 5.08,1.27
  Top 0.254: TEMP_TUBE.1 11.43,1.27 | 5.08,1.27 11.43,1.27 | 11.43,1.27 20.32,1.27 | 20.32,1.27 29.21,1.27 | 29.21,1.27 TEMP_BOILER.1 | TEMP_BU.1 20.32,1.27 | U$1.3V3 69.85,31.75 66.04,27.94 60.96,27.94 50.8,17.78 50.8,13.97 48.26,11.43 48.26,5.08 BREW_VOL.P$1 | 29.21,1.27 36.83,1.27
  Top 0.406: BUTTON_RIGHT.P$1 69.09,1.27 58.93,1.27 | 36.83,1.27 38.61,1.27 | 38.61,1.27 48.77,1.27 | 48.77,1.27 58.93,1.27 | BUTTON_LEFT.P$1 58.93,1.27 | BREW_VOL.P$1 48.77,1.27 | BREW_MAN.P$1 38.61,1.27 | v69.85,45.72 67.31,48.26 v53.34,48.26
  Bottom 0.406: v76.2,46.99 74.93,45.72 v69.85,45.72 U$1.3V3 | IC5.15 33.02,52.07 36.83,52.07 | 36.83,52.07 IC5.18 | IC5.9 39.37,48.26 | 39.37,48.26 36.83,48.26 36.83,52.07 | 39.37,48.26 v53.34,48.26
+5V  (via drill 0.35)
  Top 0.152: 12.7,25.4 10.79,25.4 IC1.4
  Top 0.2: 83.82,16.51 84.65,15.68 84.65,5.91 83.82,5.08 FLOW_RET.1 | 6.99,33.02 11.43,33.02 12.7,31.75 12.7,25.4
  Top 0.254: v5.08,33.02 6.99,33.02 IC1.8 | R20.2 82.34,21.8 83.61,21.8 83.82,21.59 83.82,16.51 R23.2
  Top 0.508: JP3.1 67.24,57.86 74.16,57.86 76.14,55.88 JP1.6
  Bottom 0.2: 69.85,8.89 69.85,9.14
  Bottom 0.254: v5.08,33.02 2.54,33.02 1.52,33.02 | BU_HEATER.P$1 2.03,60.45 1.52,60.96 | BOILER_HEATER.P$1 12.7,60.71 12.7,62.13 | R3.2 20.32,62.13 | SJ3.2 25.4,62.13 | R1.2 30.48,62.13 | SJ1.2 35.56,62.13 | R2.2 40.64,62.13 | SJ2.2 45.72,62.13 | R4.2 50.8,62.13 | SJ4.2 55.88,62.13
  Bottom 1.016: 2.54,33.02 2.54,21.59 5.08,21.59 5V.P$1 1.52,10.16 1.52,1.52 71.12,1.52 | 1.52,33.02 1.52,60.96 1.52,62.13 12.7,62.13 20.32,62.13 25.4,62.13 30.48,62.13 35.56,62.13 40.64,62.13 45.72,62.13 50.8,62.13 55.88,62.13 62.51,62.13 JP3.1 | 69.85,8.89 71.12,7.62 71.12,1.52 | 69.85,9.14 U$1.VIN | 71.12,1.52 81.53,1.52 82.55,2.54 82.55,4.95 FLOW_RET.1 FLOW_PUMP.1
BOILER_HEATER  (via drill 0.35)
  Top 0.203: U4.1 20.75,50.52 40.55,50.52 41.53,49.53 v41.91,49.53
  Bottom 0.203: v41.91,49.53 43.18,50.8 IC5.23
BOILER_VALVE  (via drill 0.35)
  Top 0.2: 66.04,52.63 67.87,52.63 JP1.4
  Top 0.203: v49.53,46.99 55.17,52.63 66.04,52.63
  Bottom 0.203: IC5.1 v49.53,46.99
BREW_MAN  (via drill 0.35)
  Top 0.2: BREW_MAN.P$2 43.61,9.74 R8.2 45.72,11.85 v45.72,38.1
  Bottom 0.2: IC5.8 40.64,41.91 40.9,41.65 44.87,41.65 45.46,41.06 45.46,39.17 45.72,38.91 v45.72,38.1
BREW_VOL  (via drill 0.35)
  Top 0.2: v46.99,38.1 46.99,25.4 v50.8,21.59 | v53.34,19.05 53.34,10.33 R7.2
  Top 0.254: R7.2 53.77,9.06 BREW_VOL.P$2
  Bottom 0.2: IC5.7 41.91,43.18 43.11,41.98 45,41.98 45.79,41.19 45.79,39.3 v46.99,38.1 | v50.8,21.59 v53.34,19.05
BU_HEATER  (via drill 0.35)
  Top 0.203: v40.64,49.53 40.26,49.53 39.63,50.16 14.76,50.16 U5.1
  Bottom 0.203: v40.64,49.53 41.91,50.8 IC5.22
BU_VALVE  (via drill 0.35)
  Top 0.2: 63.5,52.98 65.68,52.98 JP1.3
  Top 0.203: v48.26,46.99 54.25,52.98 63.5,52.98
  Bottom 0.203: IC5.2 v48.26,46.99
BUTTON_LEFT  (via drill 0.35)
  Top 0.2: v48.26,38.1 48.26,25.4 v50.8,22.86 | v54.61,19.05 55.88,17.78 55.88,12.23 R5.2
  Top 0.254: R5.2 56.81,10.5 60.96,6.35 62.23,6.35 63.93,4.65 BUTTON_LEFT.P$2
  Bottom 0.2: IC5.6 43.18,43.18 43.74,42.62 46.88,42.62 48.19,41.3 48.19,38.17 v48.26,38.1 | v50.8,22.86 v54.61,19.05
BUTTON_RIGHT  (via drill 0.35)
  Top 0.2: v52.07,22.86 49.53,25.4 v49.53,38.1 | v54.61,20.32 58.42,16.51 58.42,13.97 60.96,11.43 R6.2 74.09,5.07 BUTTON_RIGHT.P$2
  Bottom 0.2: IC5.5 44.45,43.18 44.66,42.97 46.99,42.97 48.52,41.44 48.52,39.11 v49.53,38.1 | v52.07,22.86 v54.61,20.32
EXP_VALVE  (via drill 0.35)
  Top 0.203: v45.72,46.99 54.61,55.88 JP1.1
  Bottom 0.203: IC5.4 v45.72,46.99
GND  (via drill 0.35)
  Top 0.2: 81.28,22.86 v81.28,23.88
  Top 0.254: C4.2 81.28,19.9 81.28,22.86
  other vias: 12.7,35.56 13.97,35.56 15.24,35.56 16.51,35.56 17.78,35.56 19.05,35.56 20.32,35.56 20.32,36.83 19.05,36.83 17.78,36.83 16.51,36.83 15.24,36.83 13.97,36.83 12.7,36.83 12.7,12.7 13.97,12.7 15.24,12.7 16.51,12.7 16.51,13.97 15.24,13.97 13.97,13.97 12.7,13.97 35.56,8.89 35.56,7.62 35.56,6.35 35.56,10.16 35.56,11.43 27.94,6.35 26.67,6.35 25.4,6.35 17.78,6.35 19.05,6.35 19.05,7.62 39.37,11.43 40.64,11.43 41.91,11.43 41.91,10.16 40.64,10.16 39.37,10.16 50.8,7.62 52.07,6.35 49.53,7.62 49.53,6.35 50.8,6.35 52.07,7.62 60.96,8.89 62.23,8.89 63.5,8.89 63.5,7.62 62.23,7.62 60.96,7.62 72.39,12.7 73.66,12.7 73.66,11.43 72.39,11.43 73.66,10.16 19.05,58.42 19.05,57.15 53.34,55.88 58.42,57.15 20.32,57.15 20.32,58.42 40.64,57.15 41.91,57.15 35.56,57.15 36.83,57.15 39.37,57.15 43.18,57.15 35.56,58.42 26.67,58.42 26.67,57.15 27.94,57.15 27.94,58.42 36.83,58.42 12.19,57.4 13.46,57.4 12.19,58.67 13.46,58.8 60.45,57.53 60.45,58.8 66.04,38.1 66.04,36.83 66.04,35.56 67.31,35.56 67.31,36.83 67.31,38.1 74.93,12.7 76.2,7.62 74.93,13.97 74.93,15.24 24.13,20.32 25.4,20.32 22.86,15.24 21.59,15.24 20.32,15.24 19.05,15.24 5.08,24.13 5.08,25.4 5.08,26.67 3.81,26.67 3.81,25.4 3.81,24.13 15.24,48.26 15.24,46.99 16.51,48.26 16.51,46.99 22.86,48.26 24.13,48.26 24.13,46.99 22.86,46.99 58.42,50.8 58.42,45.72 59.69,50.8 59.69,44.45 59.69,45.85 59.69,52.07 58.42,52.07 62.23,44.45 63.5,44.45 63.5,50.8 58.42,44.45 60.96,44.45 60.96,45.72 60.96,50.8 60.96,52.07 62.23,52.07 62.23,50.8 69.85,46.99 69.85,48.26 71.12,48.26 71.12,46.99 67.31,25.4 68.58,25.4 68.58,22.86 68.58,24.13 67.31,24.13 67.31,22.86 83.19,19.18 83.82,8.89 74.93,17.78 74.93,6.35 74.93,7.62 74.93,19.05 83.19,18.03 83.31,13.97 83.19,20.32 83.31,15.24 83.31,12.83 25.4,22.86 26.67,31.75 26.67,27.94 26.67,26.67 26.67,20.32 24.13,22.86 24.13,25.4 25.4,25.4 26.67,25.4 26.67,24.13 25.4,24.13 24.13,24.13 26.67,22.86 26.67,30.48 26.67,29.21 35.56,29.21 36.83,29.21 38.1,29.21 38.1,27.94 36.83,27.94 35.56,27.94 35.56,26.67 36.83,26.67 38.1,26.67 38.1,25.4 36.83,25.4 35.56,25.4 35.56,24.13 36.83,24.13 38.1,24.13 62.87,45.85 83.82,6.35 76.2,6.35 72.39,10.16 63.5,52.07 38.1,43.18 36.83,43.18 39.37,43.18
  pour Top (isolate 0.254): 0,64.77 85.09,64.77 85.09,0 0,0
  pour Bottom (isolate 0.254): 0,64.77 85.09,64.77 85.09,0 0,0
LED_LEFT  (via drill 0.35)
  Top 0.203: U3.1 26.75,50.87 41.46,50.87 42.8,49.53 v43.18,49.53
  Bottom 0.203: v43.18,49.53 45.72,52.07 IC5.25
LED_POWER  (via drill 0.35)
  Top 0.203: U1.1 32.74,51.23 42.38,51.23 44.07,49.53 v44.45,49.53
  Bottom 0.203: v44.45,49.53 46.99,52.07 IC5.26
LED_RIGHT  (via drill 0.35)
  Top 0.203: U6.1 46.99,49.68 v46.99,49.53
  Bottom 0.203: v46.99,49.53 49.53,52.07 IC5.28
LED_TANK  (via drill 0.35)
  Top 0.203: U2.1 38.73,51.59 43.29,51.59 45.34,49.53 v45.72,49.53
  Bottom 0.203: v45.72,49.53 48.26,52.07 IC5.27
N$1
  Bottom 0.254: SJ1.1 33.53,60.2 | 33.53,60.2 LED_POWER.P$1 | R1.1 33.44,60.11 33.53,60.2
N$2
  Bottom 0.254: SJ2.1 43.69,60.2 | 43.69,60.2 LED_TANK.P$1 | R2.1 43.6,60.11 43.69,60.2
N$3
  Bottom 0.254: R3.1 22.77,60.11 LED_LEFT.P$1 23.37,60.2 SJ3.1
N$4  (via drill 0.3)
  Top 0.2: Q1.1 73.22,47.69 v72.52,46.99 | v68.58,45.72 67.69,44.83 66.82,44.83 66.44,44.45 v64.77,44.45
  Bottom 0.2: v68.58,45.72 69.03,45.72 69.61,46.3 71.83,46.3 v72.52,46.99 | v64.77,44.45 62.23,41.91 U$1.D2
N$5
  Top 0.2: 45.55,57.15 45.52,57.15 42.08,53.71 U6.3
  Top 0.254: 45.55,57.15 57.15,57.15 58.59,58.59 LED_RIGHT.P$2
N$6
  Top 0.254: U3.3 22.86,53.51 22.86,55.88 27.43,60.45 LED_LEFT.P$2
N$7
  Top 0.254: U4.3 16.68,59.18 BOILER_HEATER.P$2
N$8
  Top 0.254: U5.3 10.16,53.51 10.16,58.42 8.13,60.45 BU_HEATER.P$2
N$9
  Bottom 0.254: R4.1 53.25,60.11 LED_RIGHT.P$1 53.85,60.2 SJ4.1
N$10
  Top 0.152: 8.26,21.59 IC1.2 8.26,27.94 9.53,27.94 IC1.6 | R9.1 9.74,21.59 8.26,21.59 | 8.26,21.59 C1.1
N$11
  Top 0.152: U$16.1 12,15.66 R10.2 5.08,15.66 | R11.2 5.08,15.66 | U$17.1 5.08,16.68 5.08,15.66
N$12
  Top 0.152: R11.1 C3.1
N$13
  Top 0.152: 10.16,19.05 R9.2 11.43,19.47 11.43,22.86 10.16,22.86 9.53,23.49 IC1.3 | 10.16,19.05 R10.1 | U$17.3 6.35,19.05 10.16,19.05
N$14
  Top 0.152: U$16.3 17.53,18.88 R12.2 R13.2
N$15  (via drill 0.3)
  Top 0.152: R13.1 21.59,16.93 21.59,18.63 C2.1
  Top 0.2: 29.21,21.59 22.86,21.59 19.05,21.59 v19.05,22.86 | U$2.2 18.41,28.58 v19.05,27.94
  Top 0.254: U$1.D34 41.91,17.78 38.1,21.59 29.21,21.59 | 22.86,21.59 C2.1
  Bottom 0.2: v19.05,27.94 v19.05,22.86
N$16
  Top 0.152: 17.78,27.09 R16.2
  Top 0.2: U$2.3 17.14,27.09 17.78,27.09 | R15.1 R16.2
  Top 0.203: R16.2 R14.2
N$17
  Top 0.254: PROBE.P$1 2.54,34.29 C3.2
N$18
  Top 0.152: 20.32,28.79 R16.1
  Top 0.2: U$2.1 19.68,29.43 20.32,28.79 | R16.1 21.59,31.75 22.86,33.02 39.37,33.02 39.79,32.6
  Top 0.254: U$1.D35 44.45,27.94 39.79,32.6
N$19
  Bottom 0.2: JP2.1 51.31,55.37 50.8,55.88 44.45,55.88 IC5.24
N$20
  Bottom 0.508: U$1.D5 JP7.1
N$21
  Top 0.2: 40.64,58.42 39.37,58.42 35.73,54.78 U2.3
  Top 0.254: 40.64,58.42 46.99,58.42 48.43,59.86 LED_TANK.P$2
N$22
  Bottom 0.203: IC5.12 35.56,41.91 U$1.D22
N$23
  Top 0.2: 36.15,60.45 36.12,60.45 29.38,53.71 U1.3
  Top 0.254: LED_POWER.P$2 36.15,60.45
N$24  (via drill 0.35)
  Top 0.2: v74.93,50.8 74.93,50.78 Q1.3
  Top 0.203: JP3.8 79.45,61.29 v79.45,50.8
  Bottom 0.203: v79.45,50.8 v74.93,50.8
N$25
  Top 0.2: U$1.D25 JP4.1
N$26
  Top 0.2: 77.47,58.08 77.47,58.14 76.64,58.97 68.58,58.97 67.82,59.74 JP3.3
  Top 0.203: 77.47,58.08 77.47,46.99 73.66,43.18 73.03,43.18
  Top 0.254: U$1.TX2 55.88,41.91 59.69,41.91 60.96,43.18 73.03,43.18
N$27
  Top 0.2: 78.11,57.95 78.11,57.97 76.39,59.69 71.12,59.69 70.36,60.45 JP3.4
  Top 0.203: 73.53,42.67 73.66,42.67 78.11,47.12 78.11,57.95
  Top 0.254: U$1.RX2 57.15,38.1 59.69,35.56 60.96,35.56 63.5,38.1 63.5,41.91 64.26,42.67 73.53,42.67
N$28  (via drill 0.35)
  Top 0.2: v72.39,53.34 72.39,51.42 71.96,50.98 71.96,44.42 71.12,43.59
  Top 0.254: U$1.D23 36.2,42.55 46.16,42.55 46.18,42.52 59.16,42.52 60.22,43.59 71.12,43.59
  Bottom 0.203: v72.39,53.34 72.39,61.85 JP3.5
N$29  (via drill 0.35)
  Top 0.203: JP3.6 75.44,61.12 78.46,58.09 78.46,46.98 76.26,44.78 v76.26,44.39
  Top 0.254: U$1.D32 46.99,16.51 62.23,31.75 62.23,36.2 66.04,40.01 v66.04,41.91 | v71.12,44.45 67.31,44.45 67.06,44.2 v67.06,44.24
  Bottom 0.203: v76.26,44.39 71.18,44.39 v71.12,44.45
  Bottom 0.254: v67.06,44.24 66.04,43.23 v66.04,41.91
N$30
  Top 0.2: 74.93,41.91 74.67,41.65 69.43,41.65 68.63,40.85 68.63,31.7
  Top 0.203: JP3.7 77.98,59.08 78.82,58.24 78.82,45.8 74.93,41.91
  Top 0.254: 68.63,31.7 65.27,28.35 60.03,28.35 49.53,17.85 U$1.D33
N$31
  Top 0.203: JP3.9 80.3,59.6 80.3,43.46 70.23,33.39 70.23,31.59 70.14,31.5 70.14,31.46
  Top 0.254: U$1.D14 59.69,25.4 61.82,27.53 66.21,27.53 70.14,31.46
N$32
  Top 0.2: 81.28,17.53 81.28,11.3
  Top 0.254: R21.2 R20.1 C4.1 80.43,18.38 81.15,17.65 81.28,17.53 | 81.28,11.3 FLOW_RET.3
N$33
  Top 0.254: R24.2 R23.1 C5.1 80.43,11.85 FLOW_PUMP.3
N$34
  Bottom 0.2: 35.56,40.55 35.56,40.48 36.67,39.37 36.73,39.37 | 35.31,41.66 34.29,42.68 IC5.13
  Bottom 0.203: 35.31,41.66 35.56,41.41 35.56,40.55 | 36.73,39.37 43.18,39.37 U$1.D21
N$35  (via drill 0.3)
  Top 0.2: R21.1 62.23,21.59 60.96,20.32 v60.96,17.78
  Top 0.254: R21.1 76.62,21.17 78.32,19.47 R22.2
  Bottom 0.2: v60.96,17.78 59.69,16.51 58.42,16.51 U$1.D27
N$36
  Top 0.2: U$1.D26 JP4.2
N$37
  Bottom 0.254: U$1.D15 JP5.1
N$38
  Top 0.2: U$1.D13 66.04,16.51 R24.1
  Top 0.254: R24.1 76.62,16.09 78.32,14.39 R25.2
N$39
  Top 0.254: JP6.1 U$1.D12
N$40
  Top 0.254: U$1.TX0 38.3,40.64 37.26,39.6 32.79,39.6 29.21,43.18 JP8.1
N$41
  Top 0.254: U$1.RX0 40.84,40.64 39.42,39.22 31.9,39.22 JP8.2
PUMP  (via drill 0.35)
  Top 0.203: v46.99,46.99 53.34,53.34 63.5,53.34 JP1.2
  Bottom 0.203: IC5.3 v46.99,46.99
TANK_SENSOR  (via drill 0.35)
  Top 0.2: TANK_SENSOR.P$2 8.97,51.99 11.64,49.32 14.18,49.32
  Top 0.203: R26.2 14.18,49.32 14.39,49.53 v39.37,49.53
  Bottom 0.203: v39.37,49.53 40.64,50.8 IC5.21
TEMP_BOILER  (via drill 0.3, 0.35)
  Top 0.2: v47.55,36.83 v47.55,34.29 | TEMP_BOILER.2 31.75,19.05 v33.02,20.32
  Bottom 0.2: U$1.D19 46.99,38.92 47.57,38.34 47.57,36.85 v47.55,36.83
  Bottom 0.254: v33.02,20.32 33.02,31.75 35.56,34.29 v47.55,34.29
TEMP_BU  (via drill 0.35)
  Top 0.2: TEMP_BU.2 22.86,11.43 v31.75,20.32
  Top 0.254: v58.42,38.1 59.69,39.37 U$1.D4
  Bottom 0.254: v31.75,20.32 31.75,33.02 34.29,35.56 55.88,35.56 v58.42,38.1
TEMP_TUBE  (via drill 0.35)
  Top 0.2: TEMP_TUBE.2 v30.48,20.32
  Top 0.254: U$1.D18 49.53,39.37 40.11,39.37 39.58,38.84 32.49,38.84 v30.48,36.83
  Bottom 0.254: v30.48,20.32 v30.48,36.83

### Text on the board
tDocu: VCC | GND | display | relay card | BU heater | + | boiler heater | + | LED left | + | LED power | + | LED tank | + | LED right | + | exp / valve | pump | BU / valve | boiler / valve | GND | 5V | tank | GND | probe | ESP32 | 5V | brew man | brew vol | button left | button right | supply | tube | BU | boiler | + | + | pump | return | GND | + | + | +